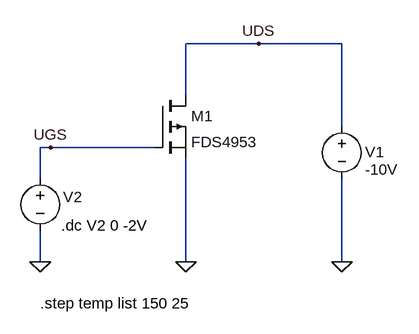
[diagram p0: schematic ID_vs_UGS-4.asc]
ID_vs_UGS-4.asc, the LTspice schematic file:
Version 4
SHEET 1 1292 680
WIRE -608 -208 -720 -208
WIRE -480 -208 -608 -208
WIRE -720 -128 -720 -208
WIRE -480 -80 -480 -208
WIRE -928 -48 -944 -48
WIRE -768 -48 -928 -48
WIRE -944 0 -944 -48
WIRE -944 128 -944 80
WIRE -720 128 -720 -32
WIRE -480 128 -480 0
FLAG -480 128 0
FLAG -944 128 0
FLAG -720 128 0
FLAG -928 -48 UGS
FLAG -608 -208 UDS
SYMBOL voltage -480 -96 R0
WINDOW 123 0 0 Left 2
WINDOW 39 37 60 Left 2
WINDOW 0 36 55 Left 2
WINDOW 3 36 82 Left 2
SYMATTR InstName V1
SYMATTR Value -10V
SYMBOL voltage -944 -16 R0
WINDOW 123 0 0 Left 2
WINDOW 39 40 53 Left 2
WINDOW 3 -97 181 Left 2
WINDOW 0 35 44 Left 2
SYMATTR Value ""
SYMATTR InstName V2
SYMBOL pmos -768 -128 R0
SYMATTR InstName M1
SYMATTR Value FDS4953
TEXT -912 72 Left 2 !.dc V2 0 -2V
TEXT -944 192 Left 2 !.step temp list 150 25

The netlist it stands for:
* ID_vs_UGS-4.asc
V1 UDS 0 -10V
V2 UGS 0
M1 UDS UGS 0 0 FDS4953
.model NMOS NMOS
.model PMOS PMOS
.lib standard.mos
.dc V2 0 -2V
.step temp list 150 25
.backanno
.end